# EAGLE design clogic (EAGLE 6.2)

## Sheet 1 of 2
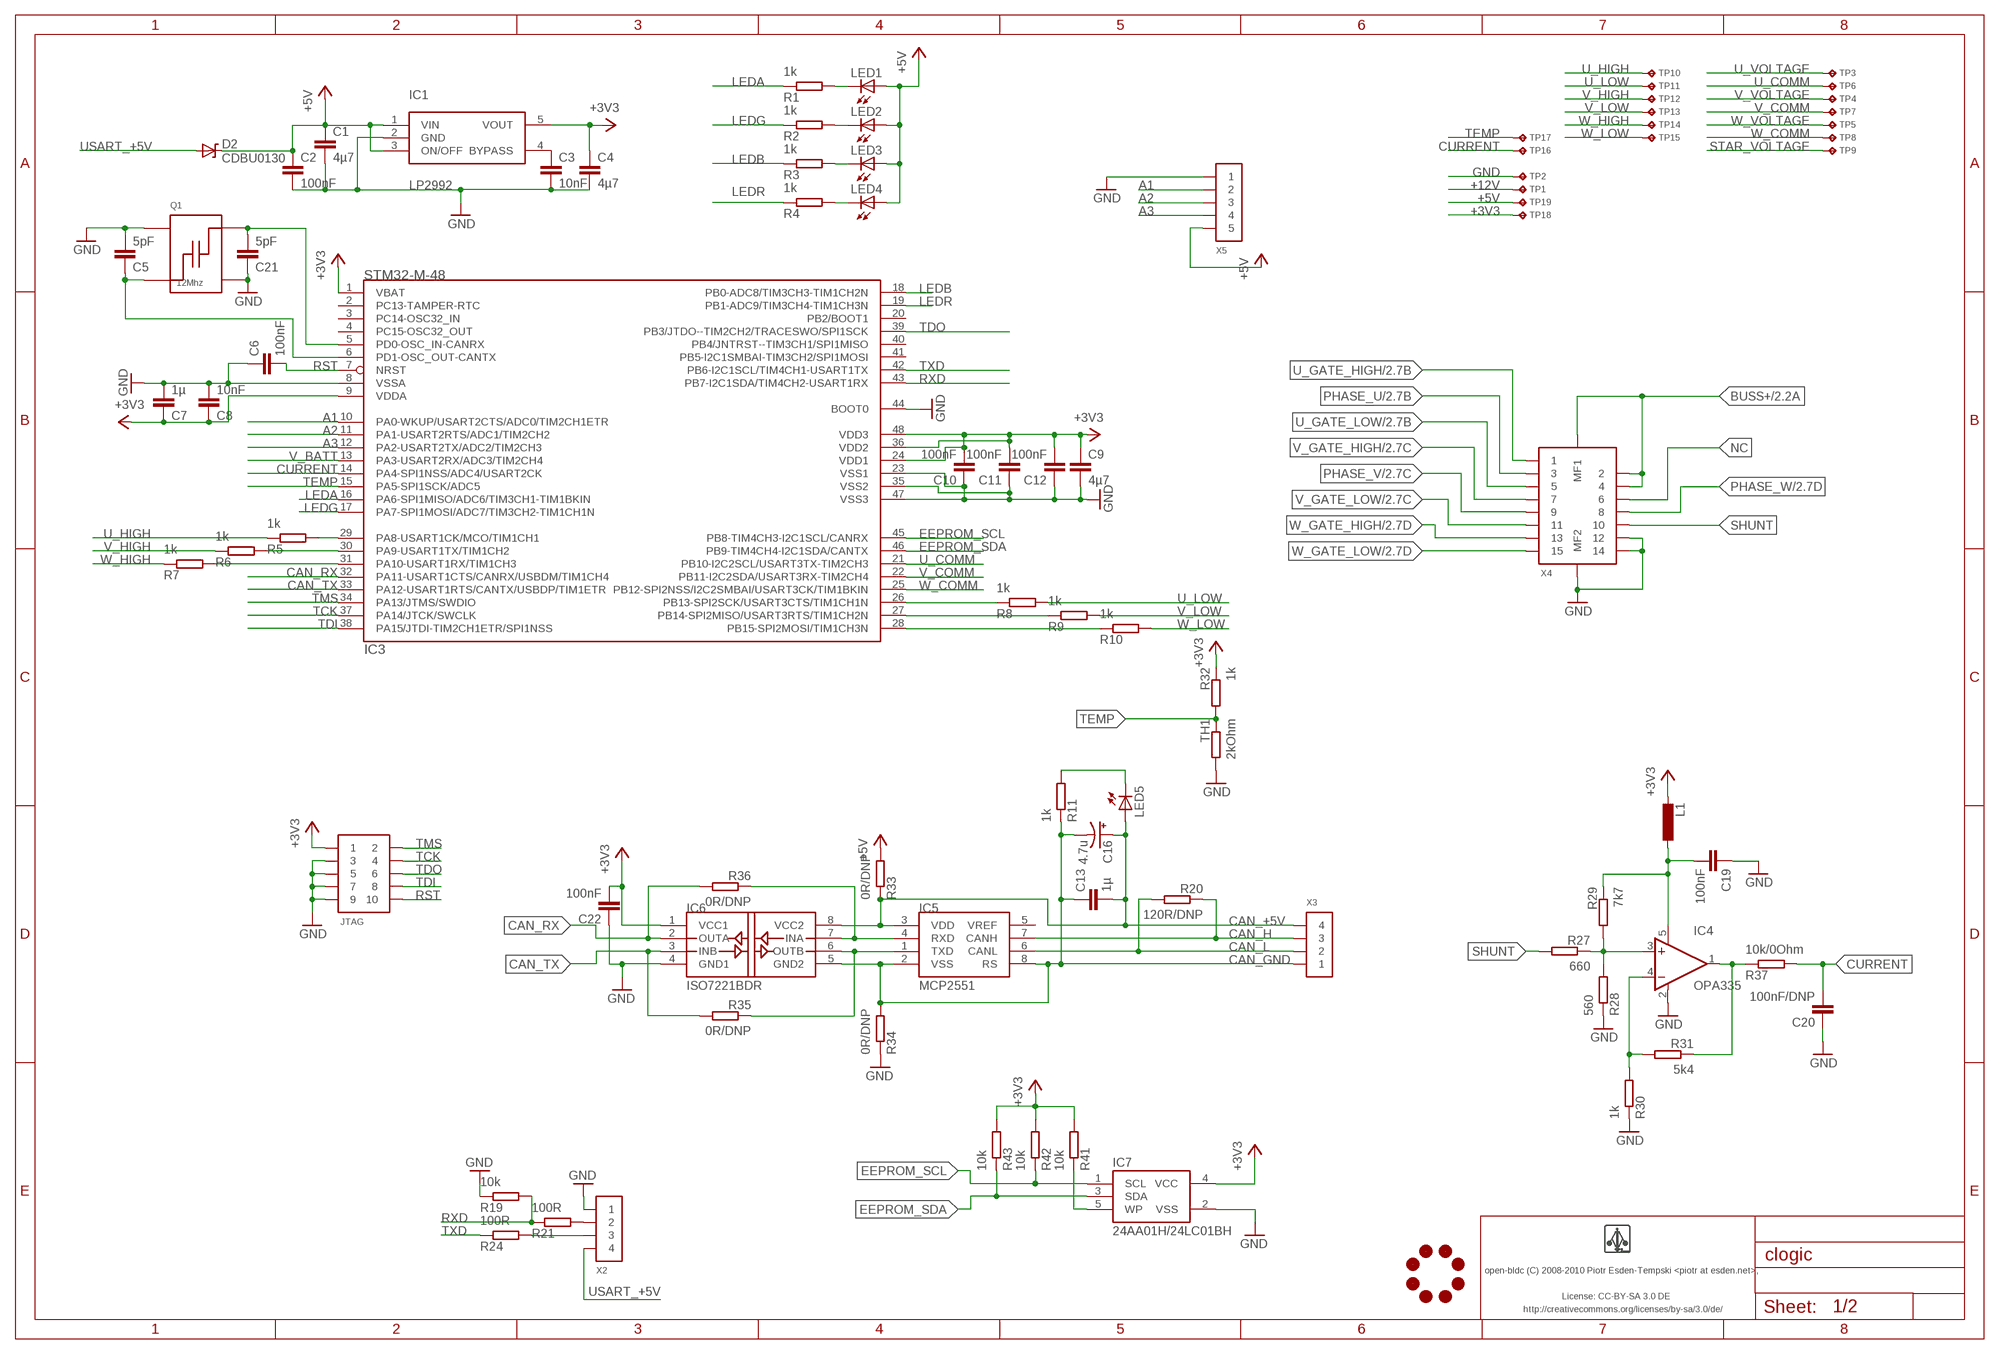
[diagram p0: schematic, sheet 1]

### Parts
C1  4µ7  CAPACITOR-0603  [0603-CAP]
C2  100nF  CAPACITOR-0603  [0603-CAP]
C3  10nF  CAPACITOR-0603  [0603-CAP]
C4  4µ7  CAPACITOR-0603  [0603-CAP]
C5  5pF  CAPACITOR-0603  [0603-CAP]
C6  100nF  CAPACITOR-0603  [0603-CAP]
C7  1µ  CAPACITOR-0603  [0603-CAP]
C8  10nF  CAPACITOR-0603  [0603-CAP]
C9  4µ7  CAPACITOR-0603  [0603-CAP]
C10  100nF  CAPACITOR-0603  [0603-CAP]
C11  100nF  CAPACITOR-0603  [0603-CAP]
C12  100nF  CAPACITOR-0603  [0603-CAP]
C13  1µ  CAPACITOR-0603  [0603-CAP]
C16  4.7u  CPOL-US  [CAP_0805TANT_F95]
C19  100nF  CAPACITOR-0603  [0603-CAP]
C20  100nF/DNP  CAPACITOR-0603  [0603-CAP]
C21  5pF  CAPACITOR-0603  [0603-CAP]
C22  100nF  CAPACITOR-0603  [0603-CAP]
D2  CDBU0130  DIODE-ZENER-0603  [0603-LED]
IC1  LP2992  [SOT23-5]
IC3  STM32-M-48  [LQFP48]
IC4  OPA335  [SOT23-5]
IC5  MCP2551  [SO8]
IC6  ISO7221BDR  ISO7221  [SO8]
IC7  24AA01H/24LC01BH  EEPROM-I2C  [SOT23-5]
JL1  JOBY_LOGO-6MIL  [JOBY_LOGO_6MIL]
JTAG  CONN_5-2-FTSH-V  [FTSH-105-DV]
L1  INDUCTOR-0603  [0603-IND]
LED1  AMBER  LED-0603  [0603-LED]
LED2  GREEN  LED-0603  [0603-LED]
LED3  BLUE  LED-0603  [0603-LED]
LED4  RED  LED-0603  [0603-LED]
LED5  WHITE  LED-0603  [0603-LED]
Q1  12Mhz  ABM8  [ABM8]
R1  1k  RESISTOR-0603  [0603-RES]
R2  1k  RESISTOR-0603  [0603-RES]
R3  1k  RESISTOR-0603  [0603-RES]
R4  1k  RESISTOR-0603  [0603-RES]
R5  1k  RESISTOR-0603  [0603-RES]
R6  1k  RESISTOR-0603  [0603-RES]
R7  1k  RESISTOR-0603  [0603-RES]
R8  1k  RESISTOR-0603  [0603-RES]
R9  1k  RESISTOR-0603  [0603-RES]
R10  1k  RESISTOR-0603  [0603-RES]
R11  1k  RESISTOR-0603  [0603-RES]
R19  10k  RESISTOR-0603  [0603-RES]
R20  120R/DNP  RESISTOR-0603  [0603-RES]
R21  100R  RESISTOR-0603  [0603-RES]
R24  100R  RESISTOR-0603  [0603-RES]
R27  660  RESISTOR-0603  [0603-RES]
R28  560  RESISTOR-0603  [0603-RES]
R29  7k7  RESISTOR-0603  [0603-RES]
R30  1k  RESISTOR-0603  [0603-RES]
R31  5k4  RESISTOR-0603  [0603-RES]
R32  1k  RESISTOR-0603  [0603-RES]
R33  0R/DNP  RESISTOR-0603  [0603-RES]
R34  0R/DNP  RESISTOR-0603  [0603-RES]
R35  0R/DNP  RESISTOR-0603  [0603-RES]
R36  0R/DNP  RESISTOR-0603  [0603-RES]
R37  10k/0Ohm  RESISTOR-0603  [0603-RES]
R41  10k  RESISTOR-0603  [0603-RES]
R42  10k  RESISTOR-0603  [0603-RES]
R43  10k  RESISTOR-0603  [0603-RES]
TH1  2kOhm  RESISTOR-0603  [0603-RES]
TP1  TP-09RSMD  [TP09R]
TP2  TP-09RSMD  [TP09R]
TP3  TP-09RSMD  [TP09R]
TP4  TP-09RSMD  [TP09R]
TP5  TP-09RSMD  [TP09R]
TP6  TP-09RSMD  [TP09R]
TP7  TP-09RSMD  [TP09R]
TP8  TP-09RSMD  [TP09R]
TP9  TP-09RSMD  [TP09R]
TP10  TP-09RSMD  [TP09R]
TP11  TP-09RSMD  [TP09R]
TP12  TP-09RSMD  [TP09R]
TP13  TP-09RSMD  [TP09R]
TP14  TP-09RSMD  [TP09R]
TP15  TP-09RSMD  [TP09R]
TP16  TP-09RSMD  [TP09R]
TP17  TP-09RSMD  [TP09R]
TP18  TP-09RSMD  [TP09R]
TP19  TP-09RSMD  [TP09R]
U$1  LOGO  LOGO-NORM  [LOGO]
X2  CONN_4-1-53261  [PB-53261-04]
X3  CONN_4-1-53261  [PB-53261-04]
X4  CONN_15-2-2MT-DF9  [DF9-15]
X5  CONN_5-1-53261  [PB-53261-05]

### Nets
+3V3: C4.P$1 C7.P$1 C8.P$1 C9.P$1 C10.P$2 C11.P$2 C12.P$2 C22.P$2 IC1.5(VOUT) IC3.1(VBAT) IC3.9(VDDA) IC3.24(VDD1) IC3.36(VDD2) IC3.48(VDD3) IC6.1(VCC1) IC7.4(VCC) JTAG.1 L1.P$2 R32.P$1 R41.P$2 R42.P$2 R43.P$2 TP18.P$1
+5V: C1.P$1 C2.P$1 D2.C IC1.1(VIN) IC1.3(ON/OFF) LED1.A LED2.A LED3.A LED4.A R33.P$2 TP19.P$1 X5.5 ; also sheet 2
+12V: TP1.P$1 ; also sheet 2
A1: IC3.10(PA0-WKUP/USART2CTS/ADC0/TIM2CH1ETR) X5.2 ; also sheet 2
A2: IC3.11(PA1-USART2RTS/ADC1/TIM2CH2) X5.3 ; also sheet 2
A3: IC3.12(PA2-USART2TX/ADC2/TIM2CH3) X5.4 ; also sheet 2
BUSS+: X4.2 X4.4 X4.MF1 ; also sheet 2
CAN_+5V: C13.P$2 C16.P$1(+) IC5.3(VDD) IC6.8(VCC2) LED5.A R33.P$1 X3.4
CAN_GND: C13.P$1 C16.P$2(-) IC5.2(VSS) IC5.8(RS) IC6.5(GND2) R11.P$1 R34.P$2 X3.1
CAN_H: IC5.7(CANH) R20.P$1 X3.3
CAN_L: IC5.6(CANL) R20.P$2 X3.2
CAN_RX: IC3.32(PA11-USART1CTS/CANRX/USBDM/TIM1CH4) IC6.2(OUTA) R36.P$2
CAN_TX: IC3.33(PA12-USART1RTS/CANTX/USBDP/TIM1ETR) IC6.3(INB) R35.P$2
CURRENT: C20.P$2 IC3.14(PA4-SPI1NSS/ADC4/USART2CK) R37.P$2 TP16.P$1
CURRENT_RAW: IC4.1(OUT) R31.P$1 R37.P$1
EEPROM_SCL: IC3.45(PB8-TIM4CH3-I2C1SCL/CANRX) IC7.1(SCL) R42.P$1
EEPROM_SDA: IC3.46(PB9-TIM4CH4-I2C1SDA/CANTX) IC7.3(SDA) R43.P$1
GND: C1.P$2 C2.P$2 C3.P$2 C4.P$2 C5.P$2 C6.P$1 C7.P$2 C8.P$2 C9.P$2 C10.P$1 C11.P$1 C12.P$1 C19.P$1 C20.P$1 C21.P$1 C22.P$1 IC1.2(GND) IC3.8(VSSA) IC3.23(VSS1) IC3.35(VSS2) IC3.44(BOOT0) IC3.47(VSS3) IC4.2(V-) IC6.4(GND1) IC7.2(VSS) JTAG.3 JTAG.5 JTAG.7 JTAG.9 Q1.P$2 Q1.P$4 R19.P$1 R28.P$1 R30.P$1 R34.P$1 TH1.P$2 TP2.P$1 X2.1 X4.12 X4.14 X4.MF2 X5.1 ; also sheet 2
LEDA: IC3.16(PA6-SPI1MISO/ADC6/TIM3CH1-TIM1BKIN) R1.P$1
LEDB: IC3.18(PB0-ADC8/TIM3CH3-TIM1CH2N) R3.P$1
LEDG: IC3.17(PA7-SPI1MOSI/ADC7/TIM3CH2-TIM1CH1N) R2.P$1
LEDR: IC3.19(PB1-ADC9/TIM3CH4-TIM1CH3N) R4.P$1
N$1: LED5.C R11.P$2
N$3: LED1.C R1.P$2
N$4: LED4.C R4.P$2
N$5: LED3.C R3.P$2
N$6: R21.P$2 X2.2
N$9: C19.P$2 IC4.5(V+) L1.P$1 R29.P$1
N$10: LED2.C R2.P$2
N$11: IC4.3(+IN) R27.P$1 R28.P$2 R29.P$2
N$12: IC4.4(-IN) R30.P$2 R31.P$2
N$13: IC5.1(TXD) IC6.6(OUTB) R35.P$1
N$14: IC5.4(RXD) IC6.7(INA) R36.P$1
N$15: C5.P$1 IC3.6(PD1-OSC_OUT-CANTX) Q1.P$1
N$17: IC7.5(WP) R41.P$1
N$18: C21.P$2 IC3.5(PD0-OSC_IN-CANRX) Q1.P$3
N$20: R24.P$2 X2.3
N$22: C3.P$1 IC1.4(BYPASS)
N$33: IC3.26(PB13-SPI2SCK/USART3CTS/TIM1CH1N) R8.P$1
N$36: IC3.27(PB14-SPI2MISO/USART3RTS/TIM1CH2N) R9.P$1
N$39: IC3.28(PB15-SPI2MOSI/TIM1CH3N) R10.P$1
N$41: IC3.29(PA8-USART1CK/MCO/TIM1CH1) R5.P$2
N$42: IC3.30(PA9-USART1TX/TIM1CH2) R6.P$2
N$45: IC3.31(PA10-USART1RX/TIM1CH3) R7.P$2
NC: X4.6
PHASE_U: X4.3 ; also sheet 2
PHASE_V: X4.9 ; also sheet 2
PHASE_W: X4.8 ; also sheet 2
RST: C6.P$2 IC3.7(NRST) JTAG.10
RXD: IC3.43(PB7-I2C1SDA/TIM4CH2-USART1RX) R19.P$2 R21.P$1
SHUNT: R27.P$2 X4.10
STAR_VOLTAGE: TP9.P$1 ; also sheet 2
TCK: IC3.37(PA14/JTCK/SWCLK) JTAG.4
TDI: IC3.38(PA15/JTDI-TIM2CH1ETR/SPI1NSS) JTAG.8
TDO: IC3.39(PB3/JTDO--TIM2CH2/TRACESWO/SPI1SCK) JTAG.6
TEMP: IC3.15(PA5-SPI1SCK/ADC5) R32.P$2 TH1.P$1 TP17.P$1
TMS: IC3.34(PA13/JTMS/SWDIO) JTAG.2
TXD: IC3.42(PB6-I2C1SCL/TIM4CH1-USART1TX) R24.P$1
U_COMM: IC3.21(PB10-I2C2SCL/USART3TX-TIM2CH3) TP6.P$1 ; also sheet 2
U_GATE_HIGH: X4.1 ; also sheet 2
U_GATE_LOW: X4.5 ; also sheet 2
U_HIGH: R5.P$1 TP10.P$1 ; also sheet 2
U_LOW: R8.P$2 TP11.P$1 ; also sheet 2
U_VOLTAGE: TP3.P$1 ; also sheet 2
USART_+5V: D2.A X2.4
V_BATT: IC3.13(PA3-USART2RX/ADC3/TIM2CH4) ; also sheet 2
V_COMM: IC3.22(PB11-I2C2SDA/USART3RX-TIM2CH4) TP7.P$1 ; also sheet 2
V_GATE_HIGH: X4.7 ; also sheet 2
V_GATE_LOW: X4.11 ; also sheet 2
V_HIGH: R6.P$1 TP12.P$1 ; also sheet 2
V_LOW: R9.P$2 TP13.P$1 ; also sheet 2
V_VOLTAGE: TP4.P$1 ; also sheet 2
W_COMM: IC3.25(PB12-SPI2NSS/I2C2SMBAI/USART3CK/TIM1BKIN) TP8.P$1 ; also sheet 2
W_GATE_HIGH: X4.13 ; also sheet 2
W_GATE_LOW: X4.15 ; also sheet 2
W_HIGH: R7.P$1 TP14.P$1 ; also sheet 2
W_LOW: R10.P$2 TP15.P$1 ; also sheet 2
W_VOLTAGE: TP5.P$1 ; also sheet 2
Unconnected: IC3.2(PC13-TAMPER-RTC) IC3.3(PC14-OSC32_IN) IC3.4(PC15-OSC32_OUT) IC3.20(PB2/BOOT1) IC3.40(PB4/JNTRST--TIM3CH1/SPI1MISO) IC3.41(PB5-I2C1SMBAI-TIM3CH2/SPI1MOSI) IC5.5(VREF)

### Notes on the sheet
- open-bldc (C) 2008-2010 Piotr Esden-Tempski <piotr at esden.net>,
- License: CC-BY-SA 3.0 DE
- http://creativecommons.org/licenses/by-sa/3.0/de/

## Sheet 2 of 2
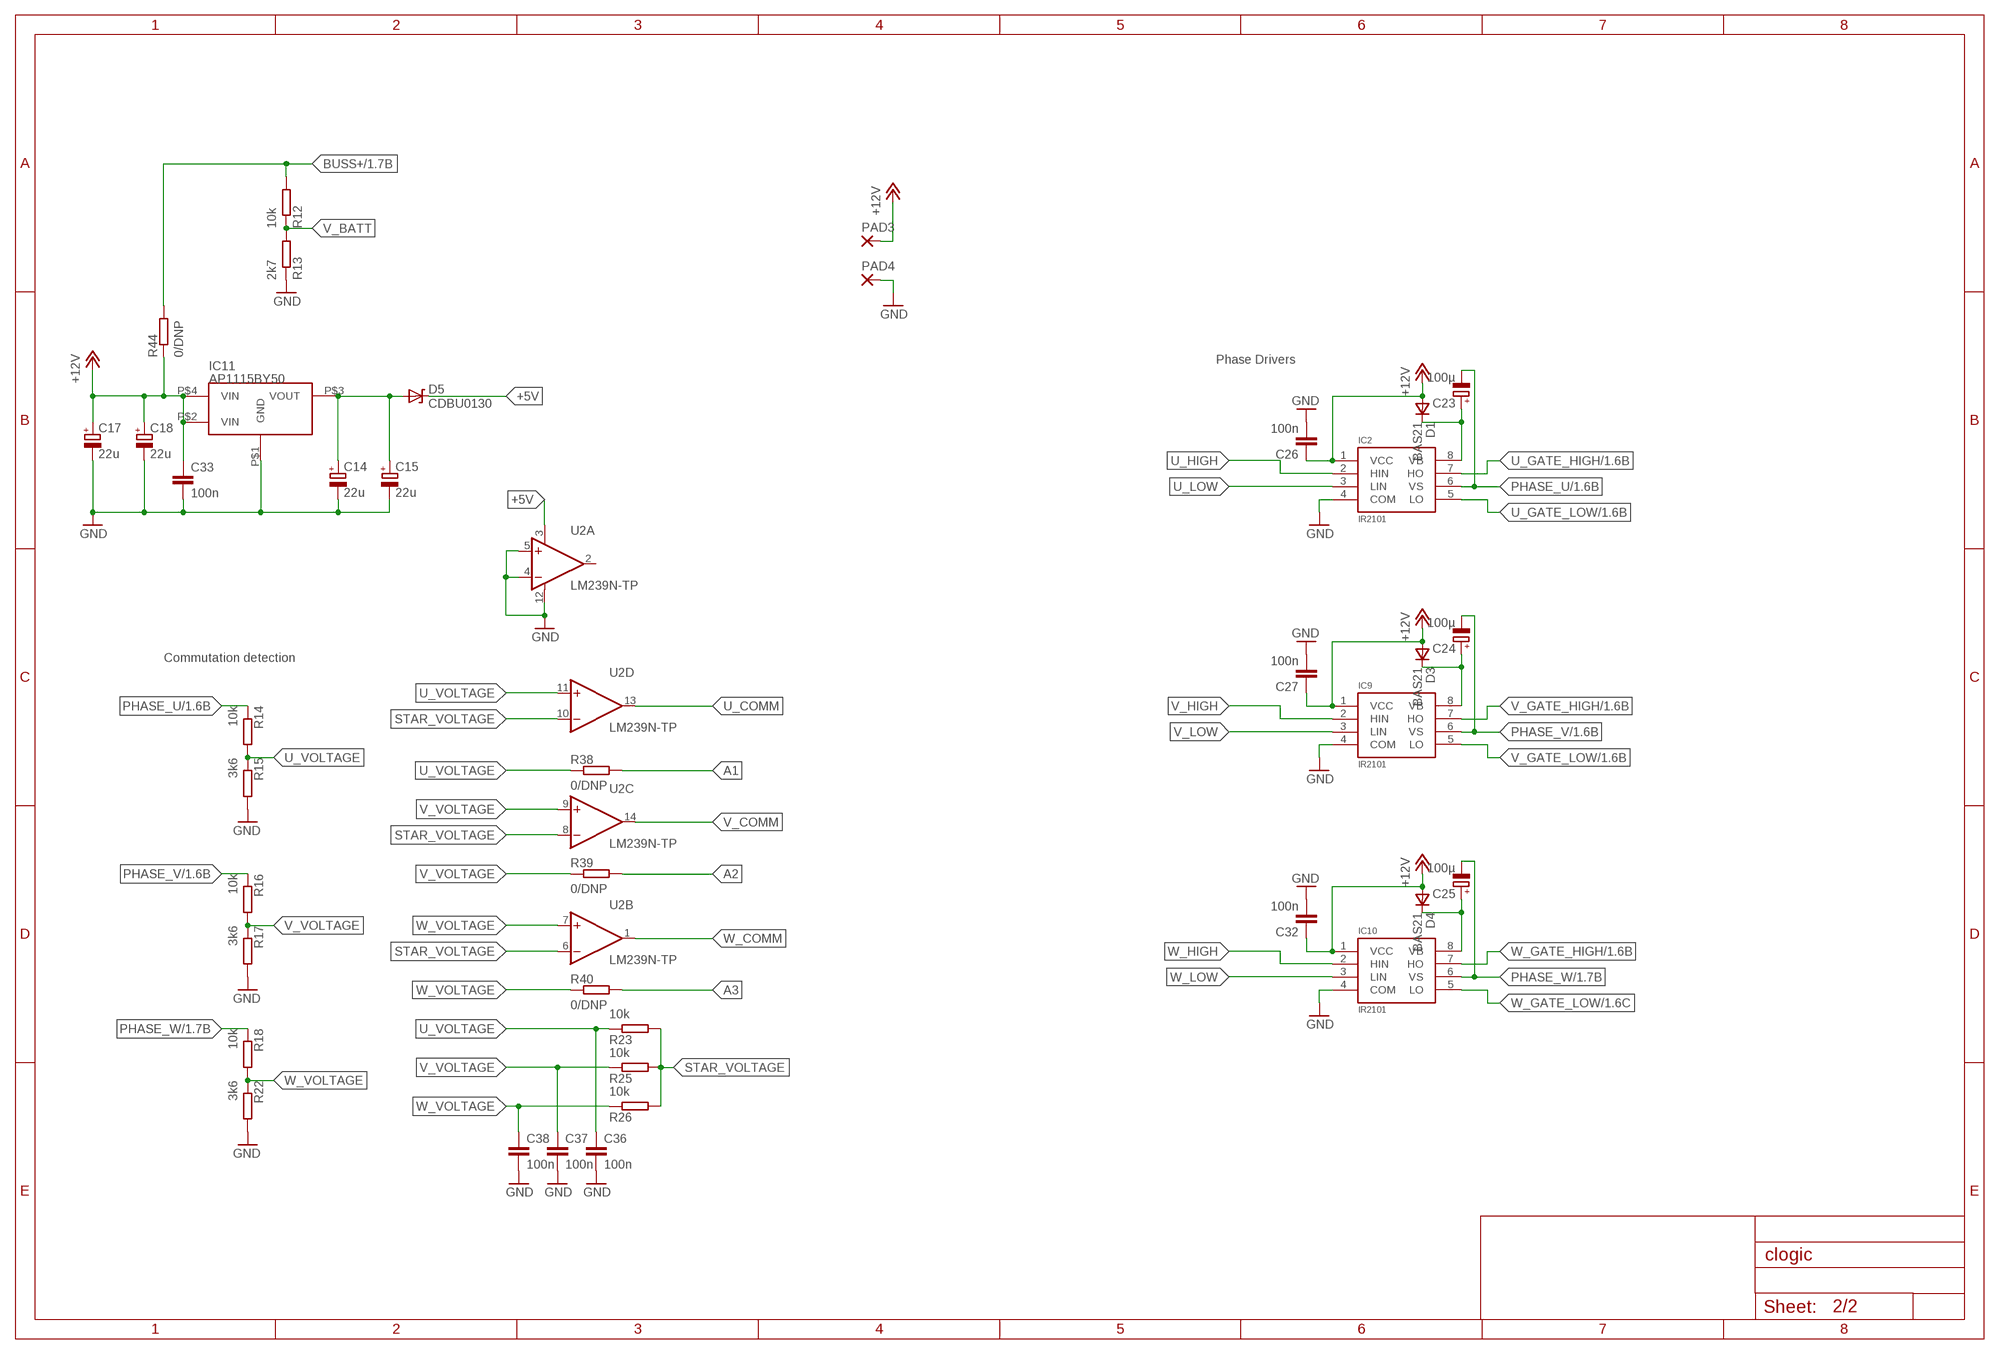
[diagram p1: schematic, sheet 2]

### Parts
C14  22u  CAPACITOR-POL-0805  [0805-POL-CAP]
C15  22u  CAPACITOR-POL-0805  [0805-POL-CAP]
C17  22u  CAPACITOR-POL-0805  [0805-POL-CAP]
C18  22u  CAPACITOR-POL-0805  [0805-POL-CAP]
C23  100µ  CAPACITOR-POL-0805  [0805-POL-CAP]
C24  100µ  CAPACITOR-POL-0805  [0805-POL-CAP]
C25  100µ  CAPACITOR-POL-0805  [0805-POL-CAP]
C26  100n  CAPACITOR-0603  [0603-CAP]
C27  100n  CAPACITOR-0603  [0603-CAP]
C32  100n  CAPACITOR-0603  [0603-CAP]
C33  100n  CAPACITOR-0603  [0603-CAP]
C36  100n  CAPACITOR-0603  [0603-CAP]
C37  100n  CAPACITOR-0603  [0603-CAP]
C38  100n  CAPACITOR-0603  [0603-CAP]
D1  BAS21  VAR2SOT23  [SOT-23]
D3  BAS21  VAR2SOT23  [SOT-23]
D4  BAS21  VAR2SOT23  [SOT-23]
D5  CDBU0130  DIODE-ZENER-0603  [0603-LED]
IC2  IR2101  [SO-8]
IC9  IR2101  [SO-8]
IC10  IR2101  [SO-8]
IC11  AP1115BY50  [SOT89]
PAD3  SMD5  [SMD2,54-5,08]
PAD4  SMD5  [SMD2,54-5,08]
R12  10k  RESISTOR-0603  [0603-RES]
R13  2k7  RESISTOR-0603  [0603-RES]
R14  10k  RESISTOR-0603  [0603-RES]
R15  3k6  RESISTOR-0603  [0603-RES]
R16  10k  RESISTOR-0603  [0603-RES]
R17  3k6  RESISTOR-0603  [0603-RES]
R18  10k  RESISTOR-0603  [0603-RES]
R22  3k6  RESISTOR-0603  [0603-RES]
R23  10k  RESISTOR-0603  [0603-RES]
R25  10k  RESISTOR-0603  [0603-RES]
R26  10k  RESISTOR-0603  [0603-RES]
R38  0/DNP  RESISTOR-0603  [0603-RES]
R39  0/DNP  RESISTOR-0603  [0603-RES]
R40  0/DNP  RESISTOR-0603  [0603-RES]
R44  0/DNP  RESISTOR-0603  [0603-RES]
U2  LM239N-TP  [TSSOP_14]

### Nets
+5V: D5.C U2.3(A:V+) ; also sheet 1
+5VOUT: C14.+ C15.+ D5.A IC11.P$3(VOUT)
+12V: C17.+ C18.+ C26.P$1 C27.P$1 C32.P$1 C33.P$1 D1.3(A) D3.3(A) D4.3(A) IC2.1(VCC) IC9.1(VCC) IC10.1(VCC) IC11.P$2(VIN) IC11.P$4(VIN) PAD3.1(P) R44.P$1 ; also sheet 1
A1: R38.P$2 ; also sheet 1
A2: R39.P$2 ; also sheet 1
A3: R40.P$2 ; also sheet 1
BUSS+: R12.P$2 R44.P$2 ; also sheet 1
GND: C14.- C15.- C17.- C18.- C26.P$2 C27.P$2 C32.P$2 C33.P$2 C36.P$2 C37.P$2 C38.P$2 IC2.4(COM) IC9.4(COM) IC10.4(COM) IC11.P$1(GND) PAD4.1(P) R13.P$1 R15.P$2 R17.P$2 R22.P$2 U2.4(A:-IN) U2.5(A:+IN) U2.12(A:V-) ; also sheet 1
N$2: C23.+ D1.1(C) IC2.8(VB)
N$7: C24.+ D3.1(C) IC9.8(VB)
N$8: C25.+ D4.1(C) IC10.8(VB)
PHASE_U: C23.- IC2.6(VS) R14.P$1 ; also sheet 1
PHASE_V: C24.- IC9.6(VS) R16.P$1 ; also sheet 1
PHASE_W: C25.- IC10.6(VS) R18.P$1 ; also sheet 1
STAR_VOLTAGE: R23.P$2 R25.P$2 R26.P$2 U2.6(B:-IN) U2.8(C:-IN) U2.10(D:-IN) ; also sheet 1
U_COMM: U2.13(D:OUT) ; also sheet 1
U_GATE_HIGH: IC2.7(HO) ; also sheet 1
U_GATE_LOW: IC2.5(LO) ; also sheet 1
U_HIGH: IC2.2(HIN) ; also sheet 1
U_LOW: IC2.3(LIN) ; also sheet 1
U_VOLTAGE: C36.P$1 R14.P$2 R15.P$1 R23.P$1 R38.P$1 U2.11(D:+IN) ; also sheet 1
V_BATT: R12.P$1 R13.P$2 ; also sheet 1
V_COMM: U2.14(C:OUT) ; also sheet 1
V_GATE_HIGH: IC9.7(HO) ; also sheet 1
V_GATE_LOW: IC9.5(LO) ; also sheet 1
V_HIGH: IC9.2(HIN) ; also sheet 1
V_LOW: IC9.3(LIN) ; also sheet 1
V_VOLTAGE: C37.P$1 R16.P$2 R17.P$1 R25.P$1 R39.P$1 U2.9(C:+IN) ; also sheet 1
W_COMM: U2.1(B:OUT) ; also sheet 1
W_GATE_HIGH: IC10.7(HO) ; also sheet 1
W_GATE_LOW: IC10.5(LO) ; also sheet 1
W_HIGH: IC10.2(HIN) ; also sheet 1
W_LOW: IC10.3(LIN) ; also sheet 1
W_VOLTAGE: C38.P$1 R18.P$2 R22.P$1 R26.P$1 R40.P$1 U2.7(B:+IN) ; also sheet 1
Unconnected: U2.2(A:OUT)

### Notes on the sheet
- Phase Drivers
- Commutation detection

## Library data of the parts
C1-C13 C19-C22 C26 C27 C32 C33 C36-C38 = pel_dipol_comp:CAPACITOR
C14 C15 C17 C18 C23-C25 = pel_dipol_comp:CAPACITOR-POL
C16 = booz_imu_h:CPOL-US: POLARIZED CAPACITOR, American symbol
D1 D3 D4 = zetex:VAR2SOT23: DIODE
D2 D5 = pel_dipol_comp:DIODE-ZENER
IC1 = open-bldc:LP2992
IC2 IC9 IC10 = open-bldc:IR2101
IC3 = pel_stm32:STM32-M-48: STM32F103 Medium Density 48pins
IC4 = open-bldc:OPA335
IC5 = open-bldc:MCP2551
IC6 = open-bldc:ISO7221
IC7 = open-bldc:EEPROM-I2C: Based on 24AA01H/24LC01BH Microchip 1K I2C Serial EEPROM with Half-Array Write-Protect datasheet.
IC11 = clogic-v0_3-r1:AP1115BY50
JL1 = open-bldc:JOBY_LOGO
JTAG = pel_misc:CONN_5-2
L1 = res_cap:INDUCTOR
LED1-LED5 = pel_dipol_comp:LED
PAD3 PAD4 = wirepad:SMD5: SMD PAD
Q1 = booz:ABM8
R1-R44 TH1 = pel_dipol_comp:RESISTOR
TP1-TP19 = pel_misc:TP
U2 = open-bldc:LM239N
U$1 = open-bldc:LOGO
X2 X3 = pel_molex:CONN_4-1
X4 = open-bldc:CONN_15-2-2MT
X5 = pel_molex:CONN_5-1

## Board
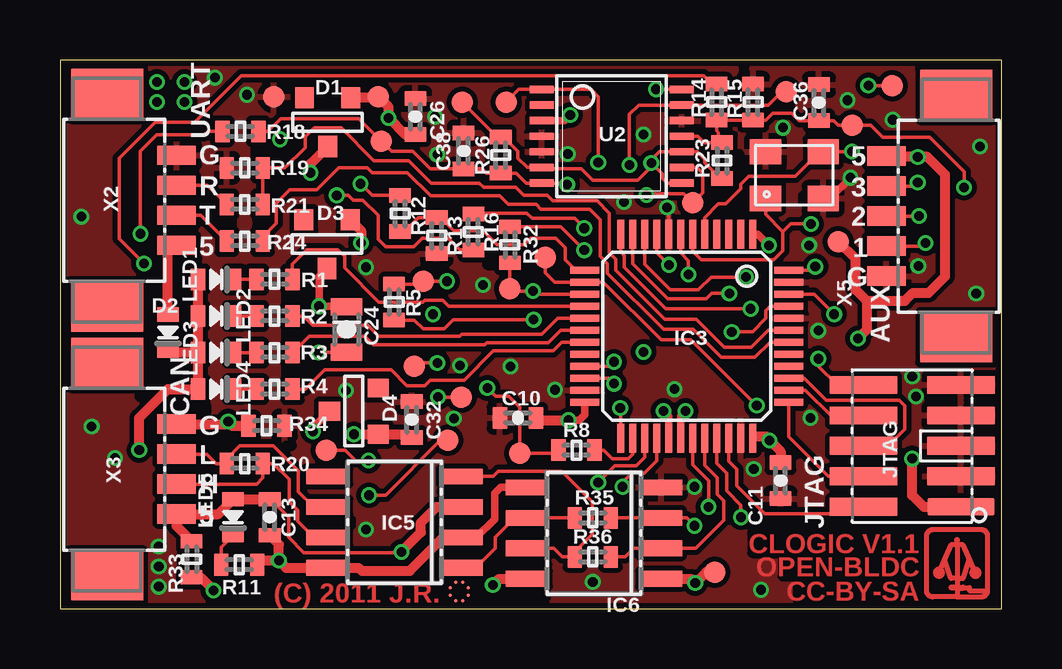
[diagram p2: board, top side]
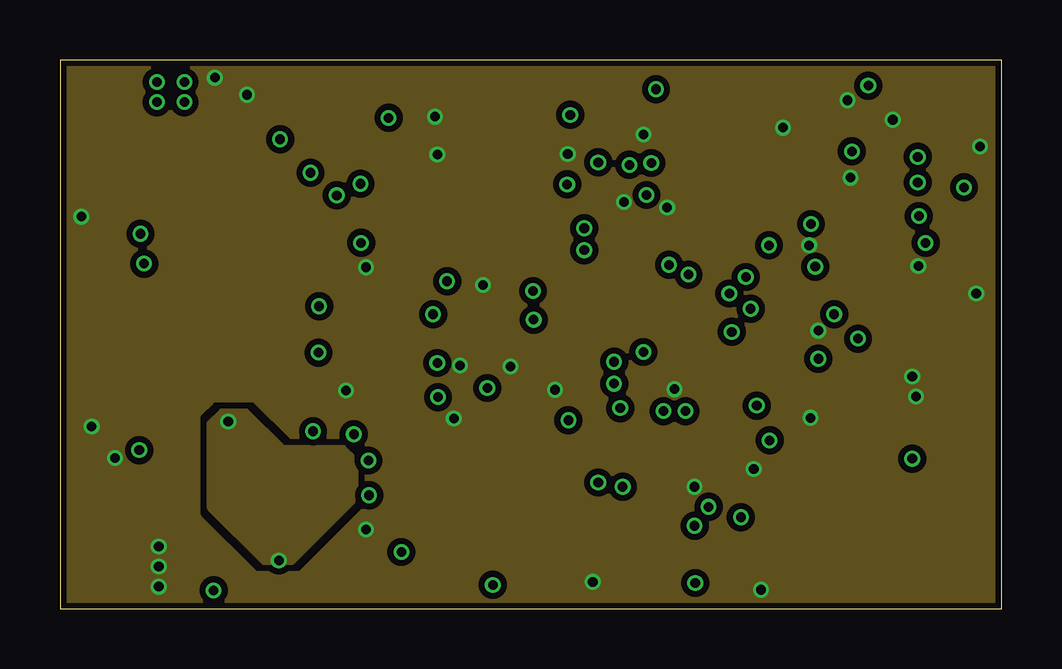
[diagram p3: board, inner layer Route2]
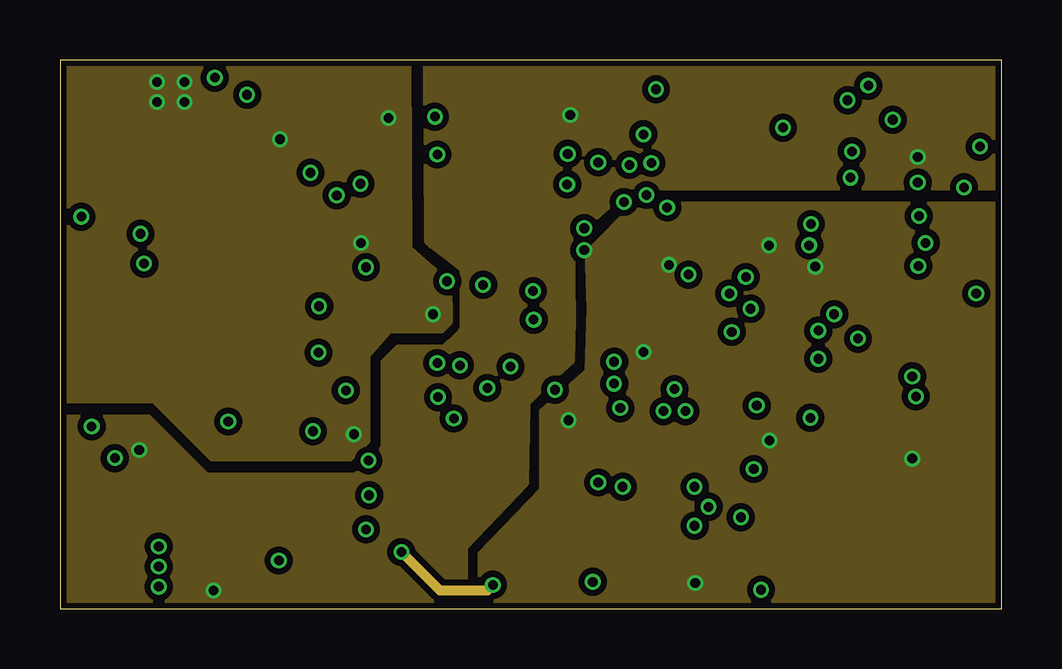
[diagram p4: board, inner layer Route15]
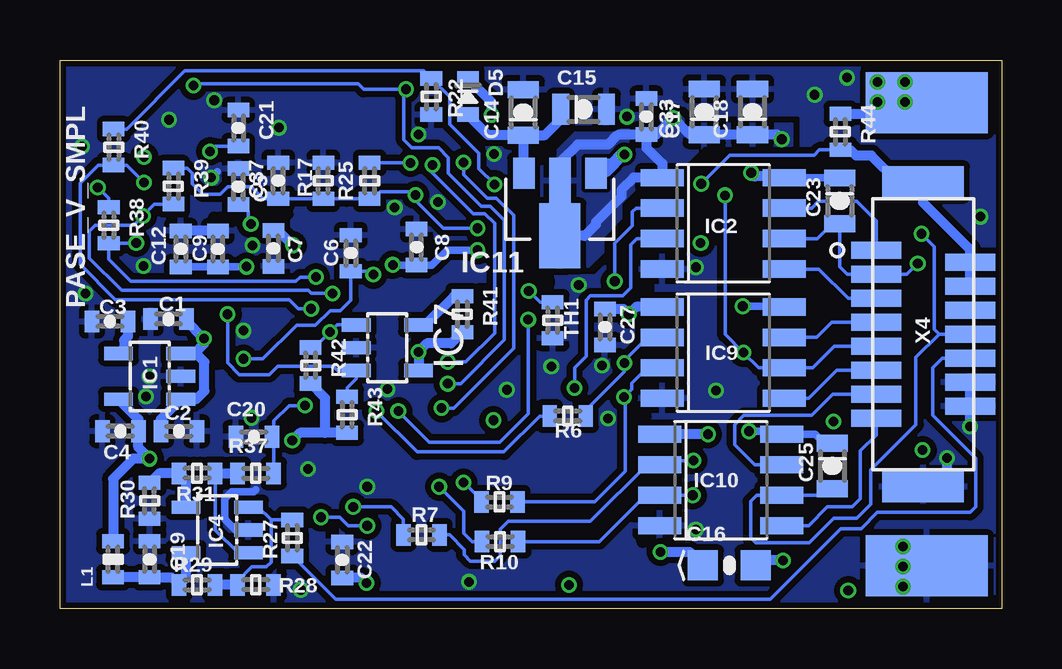
[diagram p5: board, bottom side, seen from below]

Size 39.24 x 22.86 mm. Coordinates in mm from the lower left corner, seen from the top.
Outline: 0,0 39.24,0 39.24,22.86 0,22.86 0,0
Copper layers (1*2+15*16): Top 0.035mm / dielectric 0.75mm / Route2 0.035mm / dielectric 0.15mm / Route15 0.035mm / dielectric 0.75mm / Bottom 0.035mm
Design rules: minimum track width 6mil, minimum drill 15mil, track to track 6mil, track to pad 6mil, pad to pad 6mil, via to via 6mil, smd to smd 6mil, copper to edge 10mil, drill to drill 8mil, minimum pad ring 5mil, minimum via ring 5mil, stop-mask expansion 4mil, vias tented up to drill 0.4mm, thermal gap 10mil
tRestrict: area 8.1,19 to 8.2,19.2; area 7.2,15.9 to 7.2,16.2; area 8.2,15.9 to 8.2,16.2; area 5.1,1.9 to 5.1,2.2; area 5.7,14.3 to 5.7,14.6; area 9.4,6.8 to 9.7,6.8; area 12.1,3.5 to 12.1,3.7; area 17.8,14.3 to 18,14.3; area 17.9,18.8 to 17.9,19; area 28.5,22.3 to 28.5,22.6; area 28.2,21.7 to 28.2,22; area 3.3,8.8 to 3.6,8.9; area 6.1,8.2 to 6.1,8.4; area 15.9,4.9 to 16.1,4.9; area 24,4.4 to 24.3,4.4; area 20.1,1.8 to 20.3,1.9; area 22.2,2 to 22.2,2.2; area 20,0.5 to 20.3,0.5; area 15.6,14.2 to 15.9,14.2; area 31.3,19.7 to 31.6,19.8; area 28.3,18.7 to 28.3,18.9; area 3.8,18.8 to 3.9,19; area 9.4,9.8 to 9.4,10; area 9.4,11.3 to 9.4,11.5; area 9.4,12.8 to 9.4,13.1; area 30.7,6.4 to 30.7,6.7; area 29.5,13.5 to 29.5,13.8; area 30.9,17 to 31,17.2; area 14.2,21.1 to 14.2,21.4
bRestrict: area 23.8,14.9 to 23.8,15.2; area 14.7,2.8 to 15,2.8; area 20.8,4.8 to 21,4.9; area 30.9,0.9 to 30.9,1.2; area 29.1,2.8 to 29.1,3.1; area 33.4,6.1 to 33.7,6.1; area 27.7,10.8 to 27.8,11; area 23.6,21.1 to 23.9,21.1; area 19.8,21 to 20.1,21; area 21.5,13.3 to 21.8,13.3; area 14.8,8 to 15.1,8; area 14.7,13.3 to 15,13.4; area 32.6,16.3 to 32.8,16.3; area 29.8,16.4 to 30,16.4; area 18.9,13.5 to 18.9,13.7; area 32.7,10.2 to 32.7,10.5

### Footprints (pad centres in the part's own frame; a part is rotated, then mirrored left to right if it is on the bottom)
0603-CAP = smd 0.6 x 0.9: P$1 -0.75,0; P$2 0.75,0
0805-POL-CAP = smd 0.7 x 1.3: + -0.95,0; - 0.95,0
CAP_0805TANT_F95 = smd 1.25 x 1.25: P$1 -1.1,0; P$2 1.1,0
SOT-23 = smd 0.787 x 0.889: 1 0.025,-1.016; 2 -0.94,1.016; 3 0.991,1.016
0603-LED = smd 0.6 x 0.9: A 0.75,0; C -0.75,0
SOT23-5 = smd 0.55 x 1.2: 1 -0.95,-1.3; 2 0,-1.3; 3 0.95,-1.3; 4 0.95,1.3; 5 -0.95,1.3
SO-8 = smd 0.72 x 1.78: 1 -1.905,-2.543; 2 -0.635,-2.543; 3 0.635,-2.543; 4 1.905,-2.543; 5 1.905,2.543; 6 0.635,2.543; 7 -0.635,2.543; 8 -1.905,2.543
LQFP48 = smd 0.3 x 1.2: 1 -2.75,-4.25; 2 -2.25,-4.25; 3 -1.75,-4.25; 4 -1.25,-4.25; 5 -0.75,-4.25; 6 -0.25,-4.25; 7 0.25,-4.25; 8 0.75,-4.25; 9 1.25,-4.25; 10 1.75,-4.25; 11 2.25,-4.25; 12 2.75,-4.25; 25 2.75,4.25; 26 2.25,4.25; 27 1.75,4.25; 28 1.25,4.25; 29 0.75,4.25; 30 0.25,4.25; 31 -0.25,4.25; 32 -0.75,4.25; 33 -1.25,4.25; 34 -1.75,4.25; 35 -2.25,4.25; 36 -2.75,4.25 | smd 1.2 x 0.3: 13 4.25,-2.75; 14 4.25,-2.25; 15 4.25,-1.75; 16 4.25,-1.25; 17 4.25,-0.75; 18 4.25,-0.25; 19 4.25,0.25; 20 4.25,0.75; 21 4.25,1.25; 22 4.25,1.75; 23 4.25,2.25; 24 4.25,2.75; 37 -4.25,2.75; 38 -4.25,2.25; 39 -4.25,1.75; 40 -4.25,1.25; 41 -4.25,0.75; 42 -4.25,0.25; 43 -4.25,-0.25; 44 -4.25,-0.75; 45 -4.25,-1.25; 46 -4.25,-1.75; 47 -4.25,-2.25; 48 -4.25,-2.75
SO8 = smd 0.65 x 1.75: 1 -1.905,-2.8; 2 -0.635,-2.8; 3 0.635,-2.8; 4 1.905,-2.8; 5 1.905,2.8; 6 0.635,2.8; 7 -0.635,2.8; 8 -1.905,2.8
SOT89 = smd 0.9 x 1.3: P$1 -1.5,0; P$3 1.5,0 | smd 0.9 x 1.9: P$2 0,0.3 | smd 1.7 x 2.7: P$4 0,2.6
JOBY_LOGO_6MIL = smd 0.152 x 0.152: 1 -0.152,0.381; 2 0.152,0.381; 3 0.381,0.152; 4 0.381,-0.152; 5 0.152,-0.381; 6 -0.152,-0.381; 7 -0.381,-0.152; 8 -0.381,0.152
FTSH-105-DV = smd 0.74 x 2.8: 1 -2.54,-2.03; 2 -2.54,2.03; 3 -1.27,-2.03; 4 -1.27,2.03; 5 0,-2.03; 6 0,2.03; 7 1.27,-2.03; 8 1.27,2.03; 9 2.54,-2.03; 10 2.54,2.03
0603-IND = smd 0.6 x 0.9: P$1 -0.75,0; P$2 0.75,0
SMD2,54-5,08 = smd 2.54 x 5.08: 1 0,0
ABM8 = smd 1.3 x 1.05: P$1 -1.2,-0.975; P$2 1.2,-0.975; P$3 1.2,0.975; P$4 -1.2,0.975
0603-RES = smd 0.6 x 0.9: P$1 -0.75,0; P$2 0.75,0
TP09R = smd 0.9 x 0.9: P$1 0,0
TSSOP_14 = smd 0.305 x 0.991: 1 -1.95,-2.918; 2 -1.3,-2.918; 3 -0.65,-2.918; 4 0,-2.918; 5 0.65,-2.918; 6 1.3,-2.918; 7 1.95,-2.918; 8 1.95,2.918; 9 1.3,2.918; 10 0.65,2.918; 11 0,2.918; 12 -0.65,2.918; 13 -1.3,2.918; 14 -1.95,2.918
PB-53261-04 = smd 0.8 x 1.6: 1 -1.875,1.1; 2 -0.625,1.1; 3 0.625,1.1; 4 1.875,1.1 | smd 2.1 x 3: MNT1 -4.425,-1.8; MNT2 4.425,-1.8
DF9-15 = smd 0.7 x 2.08: 1 -3.5,-1.96; 2 -3,1.96; 3 -2.5,-1.96; 4 -2,1.96; 5 -1.5,-1.96; 6 -1,1.96; 7 -0.5,-1.96; 8 0,1.96; 9 0.5,-1.96; 10 1,1.96; 11 1.5,-1.96; 12 2,1.96; 13 2.5,-1.96; 14 3,1.96; 15 3.5,-1.96 | smd 1.3 x 3.4: MF1 -6.35,0; MF2 6.35,0
PB-53261-05 = smd 0.8 x 1.6: 1 -2.5,1.1; 2 -1.25,1.1; 3 0,1.1; 4 1.25,1.1; 5 2.5,1.1 | smd 2.1 x 3: MNT1 -5.05,-1.8; MNT2 5.05,-1.8

### Placement (x,y rotation side)
C1  34.72,12.06 180 bottom
C2  34.29,7.39 0 bottom
C3  37.16,11.96 180 bottom
C4  36.73,7.39 180 bottom
C5  31.81,17.58 90 bottom
C6  27.13,14.81 270 bottom
C7  30.35,15.01 270 bottom
C8  24.38,15.06 90 bottom
C9  32.66,14.99 90 bottom
C10  19.08,7.95 0 top
C11  30.02,5.33 90 top
C12  34.21,14.99 270 bottom
C13  8.74,3.81 90 top
C14  19.94,20.68 90 bottom
C15  17.42,20.8 0 bottom
C16  11.35,1.8 0 bottom
C17  12.4,20.7 90 bottom
C18  10.39,20.7 90 bottom
C19  35.51,2.06 270 bottom
C20  31.17,7.16 0 bottom
C21  31.81,20.03 270 bottom
C22  27.48,2.03 270 bottom
C23  6.76,16.99 270 bottom
C24  11.94,11.63 270 top
C25  7.06,5.94 270 bottom
C26  14.81,20.5 90 top
C27  16.54,11.73 270 bottom
C32  14.66,7.87 90 top
C33  14.81,20.5 90 bottom
C36  31.62,21.08 90 top
C37  30.15,17.83 90 bottom
C38  16.81,19.08 90 top
D1  11.13,20.27 0 top
D2  4.5,11.51 90 top
D3  11.1,15.19 0 top
D4  12.24,8.26 270 top
D5  22.25,21.34 270 bottom
DRILEGEND  [DRILEGEND]  -1.33,-7.14 0 top  (outside the outline)
IC1  35.51,9.68 90 bottom
IC2  11.61,16.05 270 bottom
IC3  26.11,11.35 180 top
IC4  32.69,3.28 90 bottom
IC5  13.94,3.61 90 top
IC6  22.25,3.15 90 top
IC7  25.6,10.87 270 bottom
IC9  11.61,10.67 270 bottom
IC10  11.71,5.36 270 bottom
IC11  18.41,18.14 180 bottom
JL1  16.64,0.71 0 top
JTAG  35.51,6.78 90 top
L1  37.03,2.06 90 bottom
LED1  6.5,13.72 180 top
LED2  6.5,12.19 180 top
LED3  6.5,10.67 180 top
LED4  6.5,9.14 180 top
LED5  7.21,3.81 90 top
PAD3  3.12,21.08 90 bottom
PAD4  3.12,1.78 90 bottom
Q1  30.6,18.07 0 top
R1  8.94,13.72 180 top
R2  8.94,12.19 180 top
R3  8.94,10.67 180 top
R4  8.94,9.14 180 top
R5  13.92,12.78 270 top
R6  18.08,8.03 180 bottom
R7  24.18,3.07 180 bottom
R8  21.51,6.6 180 top
R9  20.93,4.45 0 bottom
R10  20.9,2.79 0 bottom
R11  7.47,1.83 180 top
R12  14.17,16.46 90 top
R13  15.7,15.54 90 top
R14  27.36,21.11 270 top
R15  28.88,21.11 90 top
R16  17.22,15.7 90 top
R17  28.27,17.83 90 bottom
R18  7.52,19.89 0 top
R19  7.7,18.36 0 top
R20  7.7,6.05 180 top
R21  7.7,16.84 180 top
R22  23.77,21.34 270 bottom
R23  27.58,18.67 270 top
R24  7.7,15.32 180 top
R25  26.34,17.83 90 bottom
R26  18.36,18.9 90 top
R27  29.57,2.95 270 bottom
R28  31.09,0.99 180 bottom
R29  33.53,0.99 0 bottom
R30  35.51,4.5 90 bottom
R31  33.53,5.64 180 bottom
R32  18.75,15.16 270 top
R33  5.49,2.06 270 top
R34  8.61,7.62 180 top
R35  22.2,3.78 0 top
R36  22.2,2.16 0 top
R37  31.09,5.64 0 bottom
R38  37.21,15.98 270 bottom
R39  34.52,17.6 270 bottom
R40  37.01,19.23 270 bottom
R41  22.48,12.27 270 bottom
R42  28.8,10.13 270 bottom
R43  27.28,8.08 270 bottom
R44  6.73,19.87 270 bottom
TH1  18.72,12.01 270 bottom
TP1  13.26,21.34 0 top
TP2  8.92,21.34 0 top
TP3  33.02,20.14 0 top
TP4  26.37,16.92 0 top
TP5  13.39,19.48 0 top
TP6  30.25,21.54 0 top
TP7  34.67,21.79 0 top
TP8  18.59,21.11 0 top
TP9  16.76,21.11 0 top
TP10  15.14,13.64 0 top
TP11  19.15,6.48 0 top
TP12  14.76,10.11 0 top
TP13  16.71,8.81 0 top
TP14  11.1,6.6 0 top
TP15  16.15,7.01 0 top
TP16  20.22,14.63 0 top
TP17  18.75,13.34 0 top
TP18  27.28,1.52 0 top
TP19  32.44,15.29 0 top
U2  22.99,19.68 270 top
U$1  37.36,1.78 0 top
X2  3.76,17.02 270 top
X3  3.76,5.82 270 top
X4  3.28,11.43 270 bottom
X5  35.53,16.36 90 top

### Tracks (layer width: path | path; a pad name or v marks a point on that pad's centre or on a via)
+3V3  (via drill 0.4, 0.4 pad 0.65)
  Top 0.152: 28.96,7.16 28.9,7.1 IC3.36 | R32.P$1 20.86,15.91 v21.84,14.94 | IC3.48 31.32,14.1 v31.47,14.25 | IC3.9 24.86,14.84 v25.38,14.33
  Top 0.305: IC3.1 29.07,15.6 v29.54,15.14 | v21.18,7.85 21.64,7.85 21.86,8.07 IC3.24
  Top 0.406: 28.96,7.16 29.41,7.16 v29.57,7.01 30.02,6.55 C11.P$2 | TP18.P$1 26.92,1.52 v26.47,1.07 26.29,1.25 IC6.1 | JTAG.1 35.99,4.24 35.51,4.72 v35.51,6.25 | v21.18,7.85 19.93,7.85 C10.P$2
  Bottom 0.305: C12.P$2 C9.P$1 31.48,14.24 v31.47,14.25 | v21.84,14.94 23.11,14.94 23.75,14.3 C8.P$1 25.36,14.31 v25.38,14.33
  Bottom 0.406: C22.P$2 26.68,1.28 v26.47,1.07 | C7.P$1 30.16,15.76 v29.54,15.14 | IC1.5 35.98,7.9 C4.P$1 35.98,6.72 v35.51,6.25 36.2,6.25 37.03,5.41 L1.P$2 | R43.P$2 28.19,7.33 | 28.19,7.33 29.25,7.33 v29.57,7.01 | R42.P$2 28.19,8.78 28.19,7.33 | R41.P$2 22.95,11.05 23.95,11.05 v24.31,10.69 v24.3,10.69 IC7.4
  pour Route15 (isolate 0.254, rank 6): 17.53,0 17.5,2.29 20.07,4.95 20.07,8.26 21.21,9.27 21.62,9.6 21.87,9.83 21.97,9.91 22.05,12.5 21.97,14.88 22.23,15.09 23.75,16.61 23.98,16.87 39.24,16.89 39.24,0
+5V  (via drill 0.4 pad 0.65)
  Top 0.305: U2.3 21.02,20.34 v21.26,20.57
  Top 0.406: LED3.A LED4.A 4.5,9.14 3.3,7.95 v3.3,6.6 | LED3.A LED2.A LED1.A | LED3.A | R33.P$2 5.86,1.31 v6.4,0.76 | D2.C 4.58,10.67 LED3.A | X5.5 34.47,18.82 v35.74,18.82 36.14,18.82 36.88,18.09 36.88,13.84 36.2,13.16 35.53,13.16 35.2,12.83 33.6,12.83 | TP19.P$1 33.15,14.58 33.15,13.28 33.6,12.83 | 33.6,12.83 33.63,12.8 33.63,11.63 v33.25,11.25
  Bottom 0.406: C2.P$1 35.04,7.9 IC1.1 33.56,8.73 33.22,9.07 33.22,10.29 33.56,10.63 33.66,10.63 | D5.C 21.26,21.09 v21.26,20.57 | 33.66,10.63 IC1.3 | 33.66,10.63 33.25,11.03 v33.25,11.25 33.97,11.97 C1.P$1
  pour Route15 (isolate 0.254, rank 6): 16.89,0 0,0 0,8 3.68,8 6.1,5.59 12.32,5.59 13.46,6.73 13.46,10.29 14.1,10.92 16,10.92 16.76,11.68 16.76,14.1 16.13,14.61 15.44,15.11 15.29,15.27 15.24,22.86 39.24,22.86 39.24,17.53 23.62,17.53 22.73,16.64 21.34,15.34 21.39,12.04 21.34,10.29 20.07,9.14 19.48,8.56 19.48,8.46 19.43,5.21 16.89,2.54
+5VOUT
  Bottom 0.406: IC11.P$3 19.94,18.14 C14.+ | C14.+ 19.04,19.73 18.37,20.39 C15.+ | C14.+ | D5.A 21.39,19.73 C14.+
+12V  (via drill 0.4, 0.4 pad 0.65)
  Top 0.406: D3.3 12.55,15.75 v12.55,15.24 | D1.3 13.21,21.29 TP1.P$1 13.69,20.9 v13.69,20.45 14.39,19.75 C33.P$1 | v12.24,7.26 D4.3 14.52,7.26 C32.P$1
  Bottom 0.152: PAD3.1 3.15,21.11 v4.04,21.11
  Bottom 0.406: IC9.1 15.24,12.57 v15.54,12.27 15.76,12.48 C27.P$1 | v9.17,19.56 9.36,19.75 C18.+ C17.+ 12.99,19.75 v13.69,20.45 14.39,19.75 C33.P$1 | C33.P$1 14.81,19.2 14.15,18.54 IC2.1 15.34,17.96 15.85,17.45 15.85,17.17 16.92,16.1 16.92,16 17.38,15.54 IC11.P$4 | IC11.P$2 18.41,18.59 17.68,19.33 16.41,19.33 16,19.74 14.82,19.74 C33.P$1 | v12.24,7.26 IC10.1 | R44.P$1 5.2,20.62 5.18,20.6 v5.18,21.11
  other vias: 4.04,21.95 5.18,21.95
  pour Route15 (isolate 0.254): 0,22.86 14.53,22.86 14.58,15.04 15.37,14.33 15.85,13.94 16.23,13.56 16.26,11.94 15.88,11.56 13.72,11.56 12.83,10.54 12.83,6.99 12.06,6.22 6.35,6.22 3.94,8.64 0,8.64
  pour Bottom: 8.76,19.3 12.45,19.3 13.34,18.41 13.34,17.65 15.11,17.65 15.88,16.89 15.88,16.26 16.64,15.49 16.64,14.86 17.27,14.22 19.18,14.22 19.18,18.41 18.03,19.56 17.91,19.68 17.78,19.81 16,19.81 15.88,19.94 14.61,19.94 13.97,20.57 13.46,20.57 13.08,20.19 8.76,20.19
A1  (via drill 0.4)
  Top 0.152: IC3.10 24.36,14.35 25.43,13.28 26.59,13.28 27.13,13.82 v28.57,13.82 | X5.2 35.94,15.11 v36.07,15.24
  Bottom 0.152: v28.57,13.82 29.23,13.82 29.41,13.64 36.3,13.64 37.21,14.55 R38.P$2 36.08,15.23 v36.07,15.24
A2  (via drill 0.4)
  Top 0.152: IC3.11 23.86,14.37 25.32,12.9 26.92,12.9 27.15,13.13 v27.89,13.13 | v35.79,16.36 X5.3
  Bottom 0.152: v27.89,13.13 28.78,13.13 28.91,13.26 36.68,13.26 38.02,14.61 38.02,15.72 37.77,15.98 36.17,15.98 v35.79,16.36 35.31,16.84 35.28,16.84 35.27,16.85 R39.P$2
A3  (via drill 0.4)
  Top 0.152: IC3.12 23.36,14.87 23.52,14.71 23.52,14.22 25.25,12.5 v28.78,12.5 | X5.4 35.59,17.61 v35.74,17.75
  Bottom 0.152: v28.78,12.5 29.31,12.5 29.69,12.88 36.93,12.88 38.41,14.35 38.41,17.73 37.66,18.48 R40.P$2 36.46,18.48 v35.74,17.75
BUSS+  (via drill 0.4 pad 0.65)
  Top 0.152: R12.P$2 14.01,17.21 13.99,17.22 13.01,17.22 v12.52,17.7
  Bottom 0.152: X4.MF1 4.34,17.78 | v12.52,17.7 11.33,18.9 7.82,18.9 7.6,19.12 R44.P$2
  Bottom 0.406: X4.MF1 3.28,16.92 1.32,14.96 X4.2 X4.4 | R44.P$2 6.32,19.12 6.07,18.87 5.44,18.87 4.34,17.78
CAN_+5V  (via drill 0.4 pad 0.65)
  Top 0.152: C13.P$2 8.78,4.56 9.53,3.81 9.53,2.97 10.16,2.34 14.2,2.34 v14.22,2.36
  Top 0.406: v14.22,2.36 15.04,3.17 15.04,3.58 15.7,4.24 IC5.3 | C13.P$2 LED5.A 6.59,3.94 X3.4 4.86,3.44 R33.P$1 | v18.03,0.99 18.29,1.25 IC6.8
  Route15 0.406: v14.22,2.36 15.82,0.76 17.8,0.76 v18.03,0.99
  Bottom 0.406: C16.P$1 13.01,2.36 v14.22,2.36
CAN_GND  (via drill 0.4 pad 0.65)
  Top 0.305: IC6.5 18.36,5.05 18.11,4.8 18.11,3.73 17.35,2.97 IC5.2
  Top 0.406: R34.P$2 7.19,7.62 v7.01,7.8 6.9,7.69 X3.1 | IC5.2 15.98,2.97 14.58,1.57 12.57,1.57 12.45,1.7 IC5.8 9.42,1.7 v9.12,2.01 | R11.P$1 8.39,2.01 v9.12,2.01 | C13.P$1 9.12,2.68 v9.12,2.01
  Bottom 0.406: C16.P$2 10.05,2.01 v9.12,2.01
  pour Route2 (isolate 0.254): 12.32,4.57 9.65,1.91 8.51,1.91 6.22,4.19 6.22,7.75 6.73,8.26 7.75,8.26 9.27,6.73 11.81,6.73 12.32,6.22
CAN_H
  Top 0.152: X3.3 8.19,5.19 8.46,5.46 8.46,6.03 R20.P$1 8.89,6.04 9.55,5.38 9.55,4.45 9.91,4.09 9.91,3.63 10.57,2.97 IC5.7
CAN_L
  Top 0.152: X3.2 4.88,6.43 6.12,6.43 6.5,6.04 R20.P$2 6.95,6.24 7.49,6.78 8.89,6.78 9.93,5.74 9.93,4.88 10.57,4.24 IC5.6
CAN_RX
  Top 0.152: IC3.32 26.86,5.98 27.38,5.46 27.38,4.78 27.66,4.5 27.66,3.68 26.49,2.52 IC6.2 23.9,2.52 23.55,2.16 R36.P$2
CAN_TX  (via drill 0.4 pad 0.65)
  Top 0.152: IC3.33 27.36,6.07 27.79,5.64 27.79,4.9 28.37,4.32 v28.37,3.81 | v26.44,3.45 26.11,3.79 IC6.3 R35.P$2
  Bottom 0.152: v28.37,3.81 27.58,3.81 27.23,3.45 v26.44,3.45
CURRENT  (via drill 0.4 pad 0.65)
  Top 0.152: TP16.P$1 20.22,13.99 20.61,13.6 IC3.14 22.64,13.6 25.04,11.2 26.29,11.2 v29.03,8.46
  Bottom 0.152: R37.P$2 30.34,7.09 C20.P$2 30.33,7.16 30.33,7.82 29.69,8.46 v29.03,8.46
CURRENT_RAW
  Bottom 0.152: IC4.1 31.82,2.33 32.77,3.28 32.78,3.29 R31.P$1
  Bottom 0.406: R31.P$1 R37.P$1
EEPROM_SCL  (via drill 0.4)
  Top 0.152: v27.99,11.53 28.85,11.53 29.41,12.09 29.41,12.42 29.59,12.6 IC3.45
  Bottom 0.152: R42.P$1 28.64,10.88 v27.99,11.53 27.7,11.82 IC7.1
EEPROM_SDA  (via drill 0.4)
  Top 0.152: IC3.46 31.42,13.1 v32.26,12.27
  Bottom 0.152: IC7.3 26.9,9.72 | IC7.3 27.68,9.92 27.86,10.11 30.18,10.11 30.53,9.75 31.77,9.75 32.26,10.24 v32.26,12.27 | IC7.3 26.9,9.57 27.28,9.2 R43.P$1
GND  (via drill 0.4, 0.4 pad 0.65)
  Top 0.152: v25.3,16.71 25.38,16.64 25.38,15.62 IC3.8
  Top 0.305: Q1.P$2 32.08,17.09 v32.94,17.96
  Bottom 0.152: 16.89,18.21 16.89,18.16 IC11.P$1
  Bottom 0.305: IC4.2 31.93,3.28 32.38,3.73 32.38,4.57 32.08,4.88 31.17,4.88 31.09,4.95 | v32.94,17.96 32.69,18.21
  Bottom 0.406: X4.12 X4.14 v1.32,7.6 v1.32,7.59 | v2.29,6.27 2.29,5.33 2.52,5.11 2.54,5.11 2.56,5.08 X4.MF2 | C9.P$2 C12.P$1 | 16.43,18.21 v15.72,18.92 15.88,18.92 16.23,18.57 16.74,18.57 16.89,18.41 16.89,18.21 16.43,18.21
  other vias: 4.11,1.75 4.11,2.59 4.11,0.91 7.8,21.41 12.75,3.3 24.31,19.76 17.63,13.49 15.62,20.5 12.75,14.22 16.66,10.13 28.91,5.82 6.45,22.12 16.41,7.92 0.89,16.33 35.51,9.68 11.91,9.09 32.82,21.18 25.6,9.14 31.27,7.95 35.76,14.27 26.44,5.08 21.16,18.95 31.6,11.58 18.77,10.08 20.62,9.12 29.21,0.79 35.66,8.84 22.2,1.12 23.5,16.94 30.12,20.04 38.18,13.13 38.33,19.25 34.7,20.37 31.22,15.14
  pour Top (isolate 0.203, rank 6): 0,0 0,22.86 39.24,22.86 39.24,0
  pour Bottom (isolate 0.254, rank 6): 0,0 0,22.86 39.24,22.86 39.24,0
  pour Route2 (isolate 0.254, rank 2): 0,0 0,22.86 39.24,22.86 39.24,0
LEDA
  Top 0.152: R1.P$1 9.68,13.72 9.68,14.35 10.29,14.96 11.58,14.96 11.86,14.68 11.86,14.2 13.28,12.78 15.11,12.78 15.19,12.85 15.95,12.85 16.2,12.6 IC3.16
LEDB
  Top 0.152: R3.P$1 10.38,11.35 12.7,11.35 13.06,11 17.7,11 17.78,11.07 20.34,11.07 20.88,11.6 IC3.18
LEDG
  Top 0.152: 9.63,12.19 R2.P$1 10.16,12.19 10.54,11.81 12.83,11.81 13.28,11.35 16.66,11.35 16.74,11.43 20.07,11.43 20.74,12.1 IC3.17
LEDR
  Top 0.152: R4.P$1 10.21,9.14 11.02,9.96 13.79,9.96 14.45,9.3 15.19,9.3 15.42,9.53 16.84,9.53 18.06,10.74 20.55,10.74 20.91,11.1 IC3.19
N$1
  Top 0.152: R11.P$2 6.72,2.56 LED5.C
N$2  (via drill 0.4 pad 0.65)
  Top 0.406: D1.1 10.44,18.54 v10.44,18.16
  Bottom 0.305: IC2.8 6.77,17.96 C23.+
  Bottom 0.406: IC2.8 9.12,18.01 10.29,18.01 v10.44,18.16
N$3
  Top 0.152: LED1.C R1.P$2
N$4
  Top 0.152: LED4.C R4.P$2
N$5
  Top 0.152: LED3.C R3.P$2
N$6
  Top 0.152: 6.95,16.93 R21.P$2 6.14,17.64 X2.2
N$7  (via drill 0.4 pad 0.65)
  Top 0.152: 11.92,12.6 C24.+
  Top 0.305: D3.1 10.79,13.84 v10.79,12.6 11.92,12.6
  Bottom 0.152: IC9.8 9.09,12.6
  Bottom 0.305: 9.09,12.6 v10.79,12.6
N$8  (via drill 0.4 pad 0.65)
  Top 0.305: D4.1 10.54,7.54 v10.54,7.39
  Bottom 0.152: IC10.8 9.29,7.39
  Bottom 0.305: 9.29,7.39 v10.54,7.39 | C25.+ 7.4,6.89 7.77,7.26 IC10.8
N$9
  Bottom 0.406: IC4.5 33.99,1.28 R29.P$1 34.59,1.31 C19.P$2 L1.P$1
N$10
  Top 0.152: LED2.C R2.P$2
N$11
  Bottom 0.152: IC4.3 30.97,4.23 30.45,3.7 | 30.45,3.7 30.45,1.94 30.64,1.74 31.25,1.74 31.84,1.15 R28.P$2 | R27.P$1 30.44,3.7 30.45,3.7
  Bottom 0.406: R28.P$2 R29.P$2
N$12
  Bottom 0.406: R30.P$2 35.12,5.64 R31.P$2 33.99,5.35 IC4.4
N$13
  Top 0.152: R35.P$1 IC6.6 18.95,3.79 18.14,2.97 18.14,2.52 17.32,1.7 IC5.1
N$14
  Top 0.152: IC5.4 18.06,5.51 18.26,5.71 20.9,5.71 22.17,4.45 22.17,3.1 21.45,2.37 R36.P$1 20.93,2.16 20.57,2.52 IC6.7
N$15  (via drill 0.4)
  Top 0.152: IC3.6 26.36,14.89 26.72,14.53 29.74,14.53 30.12,14.91 30.12,15.7 | Q1.P$1 29.4,16.43 30.12,15.7 | v31.29,16.03 30.45,16.03 30.12,15.7
  Bottom 0.152: C5.P$1 31.69,16.83 31.39,16.54 31.39,16.13 v31.29,16.03
N$17
  Bottom 0.406: R41.P$1 22.82,13.02 24.02,11.82 IC7.5
N$18  (via drill 0.4)
  Top 0.152: IC3.5 26.86,16.3 27.43,16.87 27.74,16.87 28.37,17.5 28.37,17.68 28.7,18.01 30.63,18.01 31.66,19.04 Q1.P$3 v32.99,19.04 v32.99,19.05
  Bottom 0.152: C21.P$2 32.77,19.28 v32.99,19.05
N$20
  Top 0.152: X2.3 5.87,16.39 R24.P$2
N$22
  Bottom 0.406: C3.P$1 36.41,11.34 36.58,11.18 36.58,10.86 IC1.4
N$33
  Top 0.152: R8.P$1 22.66,6.6 23.01,6.25 23.67,6.25 23.86,6.44 IC3.26
N$36  (via drill 0.4 pad 0.65)
  Top 0.152: IC3.27 24.36,6.3 24,5.94 23.11,5.94 v22.43,5.26
  Bottom 0.152: R9.P$1 21.61,4.45 v22.43,5.26
N$39  (via drill 0.4 pad 0.65)
  Top 0.152: v23.44,5.08 23.44,5.26 23.82,5.64 24.33,5.64 24.86,6.17 IC3.28
  Bottom 0.152: R10.P$1 22.07,2.79 22.43,3.15 22.43,4.06 v23.44,5.08
N$41  (via drill 0.4 pad 0.65)
  Top 0.152: v19.74,12.04 16.38,12.04 16,11.66 15.14,11.66 14.77,12.03 R5.P$2
  Top 0.305: IC3.29 25.36,8.01 v25.15,8.23
  Bottom 0.152: v19.74,12.04 19.74,8.13 20.93,6.93 23.85,6.93 v25.15,8.23
N$42  (via drill 0.4 pad 0.65)
  Top 0.305: IC3.30 25.86,8.03 v26.06,8.23
  Bottom 0.152: R6.P$2 19.25,8.03 20.75,6.53 24.36,6.53 v26.06,8.23
N$45  (via drill 0.4 pad 0.65)
  Top 0.152: v27.03,4.24 27.03,5.33 26.36,6 IC3.31
  Bottom 0.152: R7.P$2 24.93,3.72 25.45,4.24 v27.03,4.24
PHASE_U  (via drill 0.4 pad 0.65)
  Top 0.152: R14.P$1 27.16,21.86 26.82,22.2 7.54,22.2 5.61,20.27 3.96,20.27 2.46,18.77 2.46,15.42 v3.5,14.38
  Bottom 0.152: IC2.6 7.7,15.42 7.07,16.04 C23.- 6.76,14.25 6.44,13.93 X4.3 3.95,13.93 v3.5,14.38
PHASE_V  (via drill 0.4 pad 0.65)
  Top 0.152: v11.53,17.22 12.01,17.22 12.22,17.02 12.62,17.02 13.26,16.38 13.26,15.39 13.56,15.09 14.73,15.09 15.09,15.44 16.18,15.44 16.66,14.96 17.21,14.96 R16.P$1 | C24.- 10.79,10.68 v10.77,10.67
  Bottom 0.152: X4.9 6.98,10.93 7.87,10.03 IC9.6 10.13,10.03 v10.77,10.67 11.53,11.43 v11.53,17.22
PHASE_W  (via drill 0.4 pad 0.65)
  Top 0.152: v3.35,15.62 3.35,19.05 4.04,19.74 6.02,19.74 6.17,19.89 R18.P$1
  Bottom 0.152: 2.62,11.43 X4.8 | 2.62,11.43 3.58,10.46 3.58,7.67 5.46,5.79 5.46,4.34 6.04,3.76 7.01,3.76 8.03,2.74 10.26,2.74 10.46,2.95 10.46,4.47 10.21,4.72 IC10.6 7.33,4.72 C25.- | 2.62,11.43 2.82,11.63 2.82,15.09 v3.35,15.62
RST  (via drill 0.4, 0.4 pad 0.65)
  Top 0.152: IC3.7 25.86,14.83 26.19,14.5 v26.19,13.92 | JTAG.10 32.38,9.32 31.6,10.11 v31.6,10.41
  Bottom 0.152: v31.6,10.41 30.79,10.41 29.39,11.81 28.6,11.81 27.99,12.42 27.56,12.42 27.13,12.85 C6.P$2 26.33,14.06 v26.19,13.92
RXD
  Top 0.152: R21.P$1 R19.P$2 9.37,18.36 10.21,19.2 10.21,19.66 10.59,20.04 11.71,20.04 13.08,18.67 14.53,18.67 15.47,17.73 17.48,17.73 17.65,17.55 19,17.55 19.33,17.22 20.31,17.22 20.54,16.99 22.38,16.99 22.89,16.48 22.89,14.83 23.16,14.55 23.16,14.1 25.2,12.06 26.52,12.06 27.69,10.9 28.8,10.9 29.51,11.6 IC3.43
SHUNT
  Bottom 0.152: X4.10 2.47,10.43 2.87,10.03 2.87,8.05 1.09,6.27 1.09,4.24 1.32,4.01 5.18,4.01 5.87,3.33 6.71,3.33 9.65,0.38 27.74,0.38 27.75,0.38 R27.P$2
STAR_VOLTAGE  (via drill 0.4 pad 0.65)
  Top 0.152: v24.64,18.57 24.64,18.69 24.98,19.04 U2.10 26.55,19.04 26.86,18.72 26.86,18.58 27.52,17.92 R23.P$2 27.57,17.91 | TP9.P$1 18.22,19.65 R26.P$2 18.48,19.65 19.07,19.05 19.07,18.77 19.46,18.39 U2.6 20.11,18.34 21.72,18.34 22.2,17.86 24.08,17.86 24.64,18.41 v24.64,18.57 | U2.8 25.29,17.73 25.09,17.93 25.09,18.11 v24.64,18.57
  Bottom 0.152: R25.P$2 v24.65,18.58 v24.64,18.57
TCK
  Top 0.152: JTAG.4 32,5.51 30.36,7.16 IC3.37
TDI
  Top 0.152: JTAG.8 32.11,8.05 31.09,9.07 31.05,9.1 IC3.38
TDO
  Top 0.152: JTAG.6 34.52,6.78 35.2,7.47 35.2,8.46 34.98,8.69 31.93,8.69 31.01,9.6 IC3.39
TEMP  (via drill 0.4 pad 0.65)
  Top 0.152: TP17.P$1 18.75,13.41 | TP17.P$1 18.85,13.23 v19.71,13.23 19.84,13.1 IC3.15 | TP17.P$1 R32.P$2
  Bottom 0.152: TH1.P$1 19.24,12.76 v19.71,13.23
TMS
  Top 0.152: IC3.34 27.86,6.15 28.19,5.82 28.19,5.13 29.36,3.96 30.61,3.96 33.48,3.96 JTAG.2
TXD
  Top 0.152: R24.P$1 8.45,15.48 9.02,16.05 9.02,16.89 9.58,17.45 10.69,17.45 11.61,18.36 12.8,18.36 13.01,18.16 14.48,18.16 15.44,17.2 18.31,17.2 18.67,16.84 19.83,16.84 20.04,16.64 22.07,16.64 22.5,16.2 22.5,14.68 22.81,14.38 22.81,13.97 25.15,11.63 26.39,11.63 27.56,10.46 28.96,10.46 29.59,11.1 IC3.42
U_COMM  (via drill 0.4)
  Top 0.152: TP6.P$1 30.07,21.54 29.52,20.98 U2.13 24.11,20.98 23.72,20.6 v23.72,18.49 | v23.09,10.29 22.91,10.1 IC3.21
  Bottom 0.152: v23.72,18.49 23.72,18.16 22.02,16.46 21.54,16.46 21.13,16.05 21.13,11.48 22.33,10.29 v23.09,10.29
U_GATE_HIGH
  Bottom 0.152: X4.1 5.24,16.16 6.04,16.97 7.64,16.97 7.92,16.69 IC2.7
U_GATE_LOW
  Bottom 0.152: X4.5 6.4,12.93 7.62,14.15 IC2.5
U_HIGH  (via drill 0.4 pad 0.65)
  Top 0.152: v16.13,13.64 TP10.P$1 15.03,13.53 R5.P$1
  Bottom 0.152: IC2.2 15.24,16.69 15.39,16.54 15.39,15.95 16.13,15.21 v16.13,13.64
U_LOW  (via drill 0.4 pad 0.65)
  Top 0.152: v17.8,9.2 18.16,8.84 18.69,8.84 19.15,8.38 TP11.P$1 20.64,6.48 R8.P$2
  Bottom 0.152: IC2.3 15.21,15.42 15.47,15.16 15.47,13.36 15.8,13.03 17.14,13.03 17.32,12.85 17.32,10.52 17.8,10.03 v17.8,9.2
U_VOLTAGE  (via drill 0.4)
  Top 0.152: U2.11 26.58,19.68 26.85,19.42 R23.P$1 27.43,19.57 27.43,19.84 27.36,19.91 R14.P$2 R15.P$1 29.4,20.36 29.69,20.65 30.48,20.65 30.8,20.33 C36.P$1 32.25,20.33 32.44,20.14 TP3.P$1 33.78,20.14 34.29,19.63 36.25,19.63 37.67,18.21 v37.67,17.55
  Bottom 0.152: R38.P$1 37.21,17.09 v37.67,17.55
USART_+5V
  Top 0.406: X2.4 4.5,15.14 D2.A
V_BATT
  Top 0.152: IC3.13 21.48,14.1 21.06,14.53 21.06,15.04 20.65,15.44 19.61,15.44 19.33,15.16 18.21,15.16 17.63,15.75 16.41,15.75 15.86,16.3 R13.P$2 14.92,16.3 14.34,15.71 R12.P$1
V_COMM  (via drill 0.4, 0.4 pad 0.65)
  Top 0.152: v33.68,21.79 TP7.P$1 | U2.14 v24.83,21.64 | v23.09,9.37 22.86,9.6 IC3.22
  Bottom 0.152: v23.09,9.37 22.55,9.37 20.73,11.2 20.73,16.18 21.31,16.76 21.69,16.76 23.06,18.14 23.06,18.8 23.47,19.2 24.59,19.2 24.92,19.53 24.92,21.56 v24.83,21.64 26.59,21.64 26.82,21.87 33.6,21.87 v33.68,21.79
V_GATE_HIGH
  Bottom 0.152: X4.7 7.09,11.93 7.72,11.3 IC9.7
V_GATE_LOW
  Bottom 0.152: X4.11 6.88,9.93 8.05,8.76 IC9.5
V_HIGH  (via drill 0.4 pad 0.65)
  Top 0.152: TP12.P$1 14.88,10.24 v15.72,10.24
  Bottom 0.152: IC9.2 14.76,11.3 15.72,10.34 v15.72,10.24 15.72,9.88 16.99,8.61 17.34,8.27 R6.P$1
V_LOW  (via drill 0.4 pad 0.65)
  Top 0.152: v15.75,8.81 TP13.P$1
  Bottom 0.152: R9.P$2 16.97,4.45 15.7,5.71 15.7,8.76 v15.75,8.81 15.42,9.14 15.42,9.4 14.78,10.03 IC9.3
V_VOLTAGE  (via drill 0.4, 0.4 pad 0.65)
  Top 0.152: v21.84,15.85 21.44,16.26 19.68,16.26 19.46,16.48 17.26,16.48 R16.P$2 | v24.44,17.23 v24.44,17.25 24.49,17.3 25.98,17.3 TP4.P$1 26.77,17.32 26.77,18.14 26.52,18.39 U2.9
  Bottom 0.152: v21.84,15.85 23.27,15.85 24.43,17.02 v24.43,17.23 v24.44,17.23 24.55,17.35 24.55,17.36 25.9,17.36 26.18,17.08 R25.P$1 27.29,17.08 27.3,17.07 28.26,17.07 R17.P$1 C37.P$1 30.77,17.08 31.27,17.58 32.26,17.58 32.56,17.27 33.3,17.27 33.73,17.7 33.73,18.14 33.95,18.35 R39.P$1
W_COMM  (via drill 0.4)
  Top 0.152: TP8.P$1 19.12,21.64 U2.1 22.13,21.64 22.43,21.34 v22.43,18.59 | IC3.25 23.36,8.34 v23.34,8.36
  Bottom 0.152: v22.43,18.59 22.43,18.09 21.44,17.09 21.06,17.09 20.34,16.38 20.34,10.85 22.84,8.36 v23.34,8.36
W_GATE_HIGH
  Bottom 0.152: X4.13 7.05,8.93 7.92,8.05 10.74,8.05 11.12,7.67 11.12,6.83 10.29,5.99 IC10.7
W_GATE_LOW
  Bottom 0.152: X4.15 5.24,7.24 5.89,6.58 5.89,4.57 6.22,4.24 7.26,4.24 8.05,3.45 IC10.5
W_HIGH  (via drill 0.4 pad 0.65)
  Top 0.152: TP14.P$1 11.89,6.6 12.32,6.17 v12.85,6.17
  Bottom 0.152: v12.85,6.17 13.56,6.17 13.74,5.99 IC10.2 14.78,5.99 17.14,3.63 20.57,3.63 20.9,3.3 20.9,2.21 21.13,1.98 22.15,1.98 22.4,2.23 22.4,2.46 23.01,3.07 R7.P$1
W_LOW  (via drill 0.4 pad 0.65)
  Top 0.152: v12.88,4.72 13.56,4.72 15.85,7.01 TP15.P$1
  Bottom 0.152: v12.88,4.72 IC10.3 14.83,4.72 16.76,2.79 R10.P$2
W_VOLTAGE  (via drill 0.4 pad 0.65)
  Top 0.152: R18.P$2 8.66,19.89 9.2,20.42 12.45,20.42 TP5.P$1 13.82,19.05 14.71,19.05 15.43,18.32 C38.P$1 17.59,18.32 17.77,18.15 R26.P$1 19.01,18.15 19.43,17.73 U2.7 21.08,17.73 v21.13,17.68
  Bottom 0.152: v21.13,17.68 21.79,18.34 21.79,18.97 23.01,20.19 23.01,21.32 R22.P$1 24.09,22.4 34.04,22.4 36.46,19.98 R40.P$1

### Text on the board
Top: CLOGIC V1.1 | OPEN-BLDC | (C) 2011 J.R. | CC-BY-SA
tPlace: UART | G | 5 | 3 | R | 2 | T | 5 | 1 | G | CAN | AUX | G | L | JTAG | H | 5
bPlace: PASE_V_SMPL
tStop: CLOGIC V1.0 | OPEN-BLDC | (C) 2011 J.R. | CC-BY-SA